# Altium schematic sheet Input.SchDoc
size 420 x 297 mm; SheetNumber: 2; SheetTotal: 6
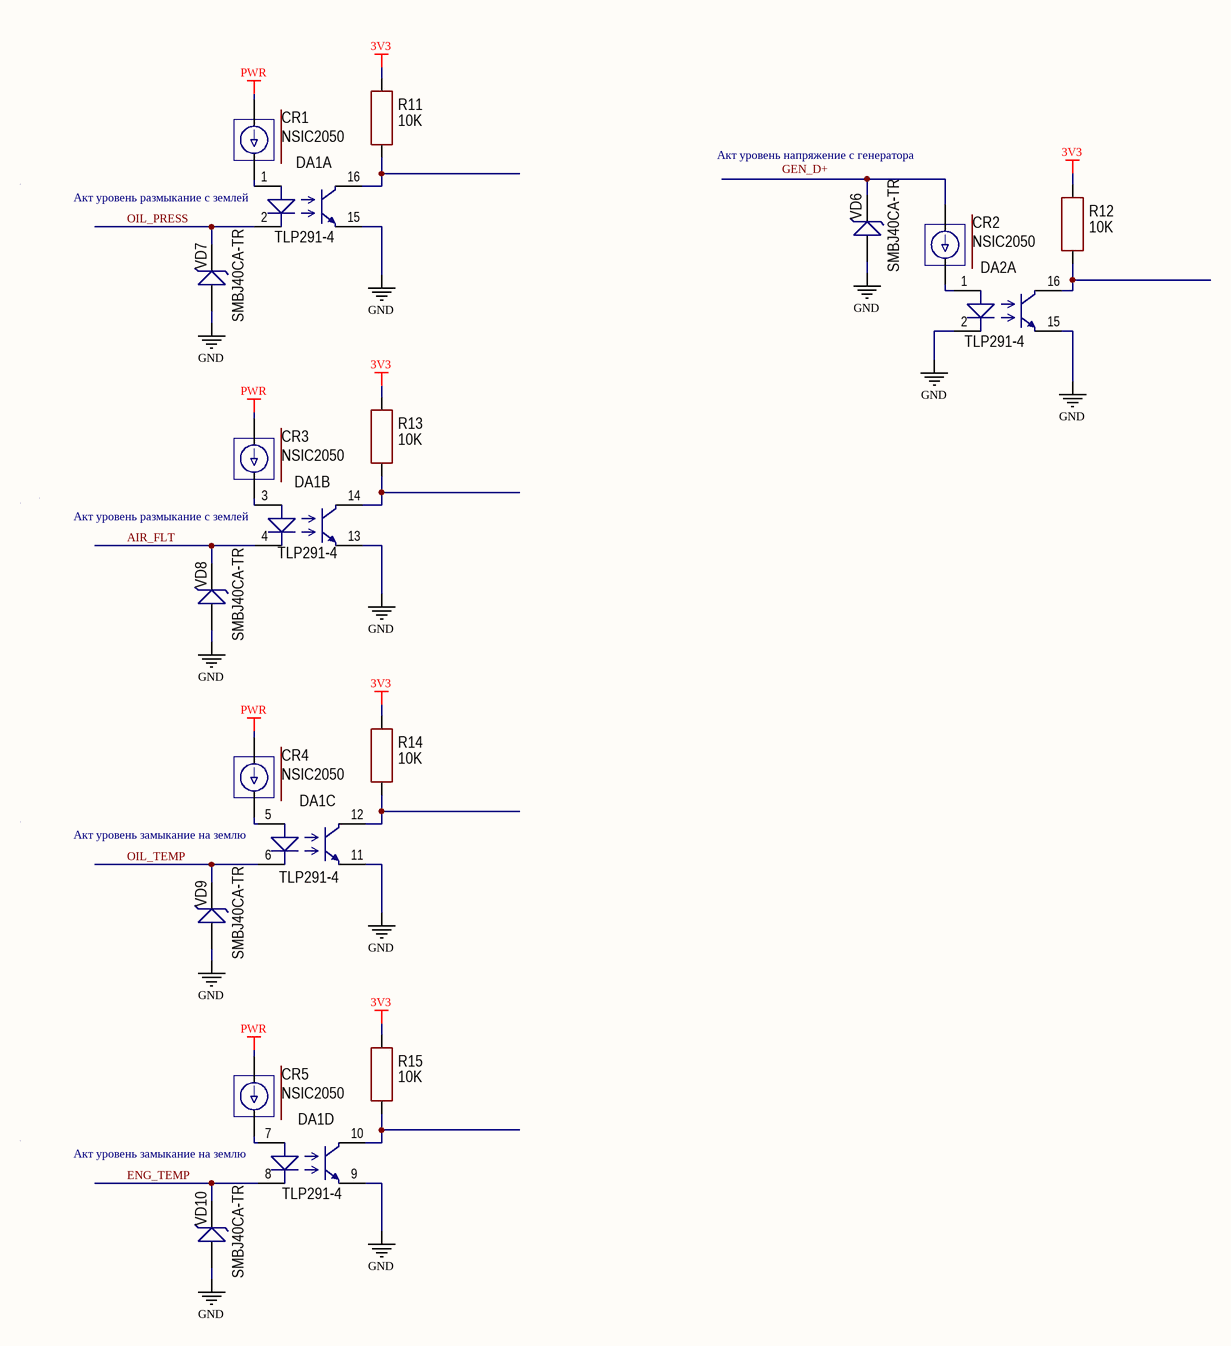
[diagram p0: Input.SchDoc]

## Parts
CR1  value NSIC2050  [SMB1]  (hidden comment: NSIC20XX)
CR2  value NSIC2050  [SMB1]  (hidden comment: NSIC20XX)
CR3  value NSIC2050  [SMB1]  (hidden comment: NSIC20XX)
CR4  value NSIC2050  [SMB1]  (hidden comment: NSIC20XX)
CR5  value NSIC2050  [SMB1]  (hidden comment: NSIC20XX)
DA1  TLP291-4  [SOP16]  (parts A,B,C,D of 4)
DA2  TLP291-4  [SOP16]  (part A of 4)
R11  value 10K  [RES: 1206]
R12  value 10K  [RES: 1206]
R13  value 10K  [RES: 1206]
R14  value 10K  [RES: 1206]
R15  value 10K  [RES: 1206]
VD6  value SMBJ40CA-TR  [SMB]  (hidden comment: suppressor)
VD7  value SMBJ40CA-TR  [SMB]  (hidden comment: suppressor)
VD8  value SMBJ40CA-TR  [SMB]  (hidden comment: suppressor)
VD9  value SMBJ40CA-TR  [SMB]  (hidden comment: suppressor)
VD10  value SMBJ40CA-TR  [SMB]  (hidden comment: suppressor)

## Nets
3V3: R11.2 R12.2 R13.2 R14.2 R15.2
GND: DA1.9 DA1.11 DA1.13 DA1.15 DA2.2 DA2.15 VD6.2 VD7.2 VD8.2 VD9.2 VD10.2
PWR: CR1.A CR3.A CR4.A CR5.A
AIR_FLT: DA1.4 VD8.1
ENG_TEMP: DA1.8 VD10.1
OIL_PRESS: DA1.2 VD7.1
OIL_TEMP: DA1.6 VD9.1
NetCR1_K: CR1.K DA1.1
NetCR2_A: CR2.A VD6.1
NetCR2_K: CR2.K DA2.1
NetCR3_K: CR3.K DA1.3
NetCR4_K: CR4.K DA1.5
NetCR5_K: CR5.K DA1.7
NetDA1_10: DA1.10 R15.1
NetDA1_12: DA1.12 R14.1
NetDA1_14: DA1.14 R13.1
NetDA1_16: DA1.16 R11.1
NetDA2_16: DA2.16 R12.1

## Notes on the sheet
- Акт уровень напряжение с генератора
- (near DA1) Акт уровень размыкание с землей
- Акт уровень замыкание на землю
- Labels drawn without touching a wire or pin: GEN_D+
- Подп. и дата
- Инв. № дубл.
- Взам. инв. №
- Инв. № подл.
- Изм.
- Лист
- № докум.
- Подп.
- Дата
- 2.106-A3
- Копировал
- Формат А3

## Library data of the parts
CR1-CR5 = NSIC20XX: pin to pad: A>2 K>1
R11-R15 = Resistor_1206: Manufacturer: Yageo; PartNumber: RC1206JR-07100RL; ValueManufacturerPartNumber: Resistor film, 10K, ±5%, 1206, 0.25W, -55...+125°C; TypeResistor: Resistor film; Power: 0.25W; Tolerance: ±5%; Package: 1206; HelpURL: https://www.digikey.com/product-detail/en/yageo/RC1206JR-07100RL/311-100ERCT-ND/732153; Temperature: -55...+125°C
DA1 DA2 = TLP291-4: Value: TLP291-4